# EasyEDA Pro project 3轴6.0__esp32.eprj, board ESP32-AXIS3-6.0
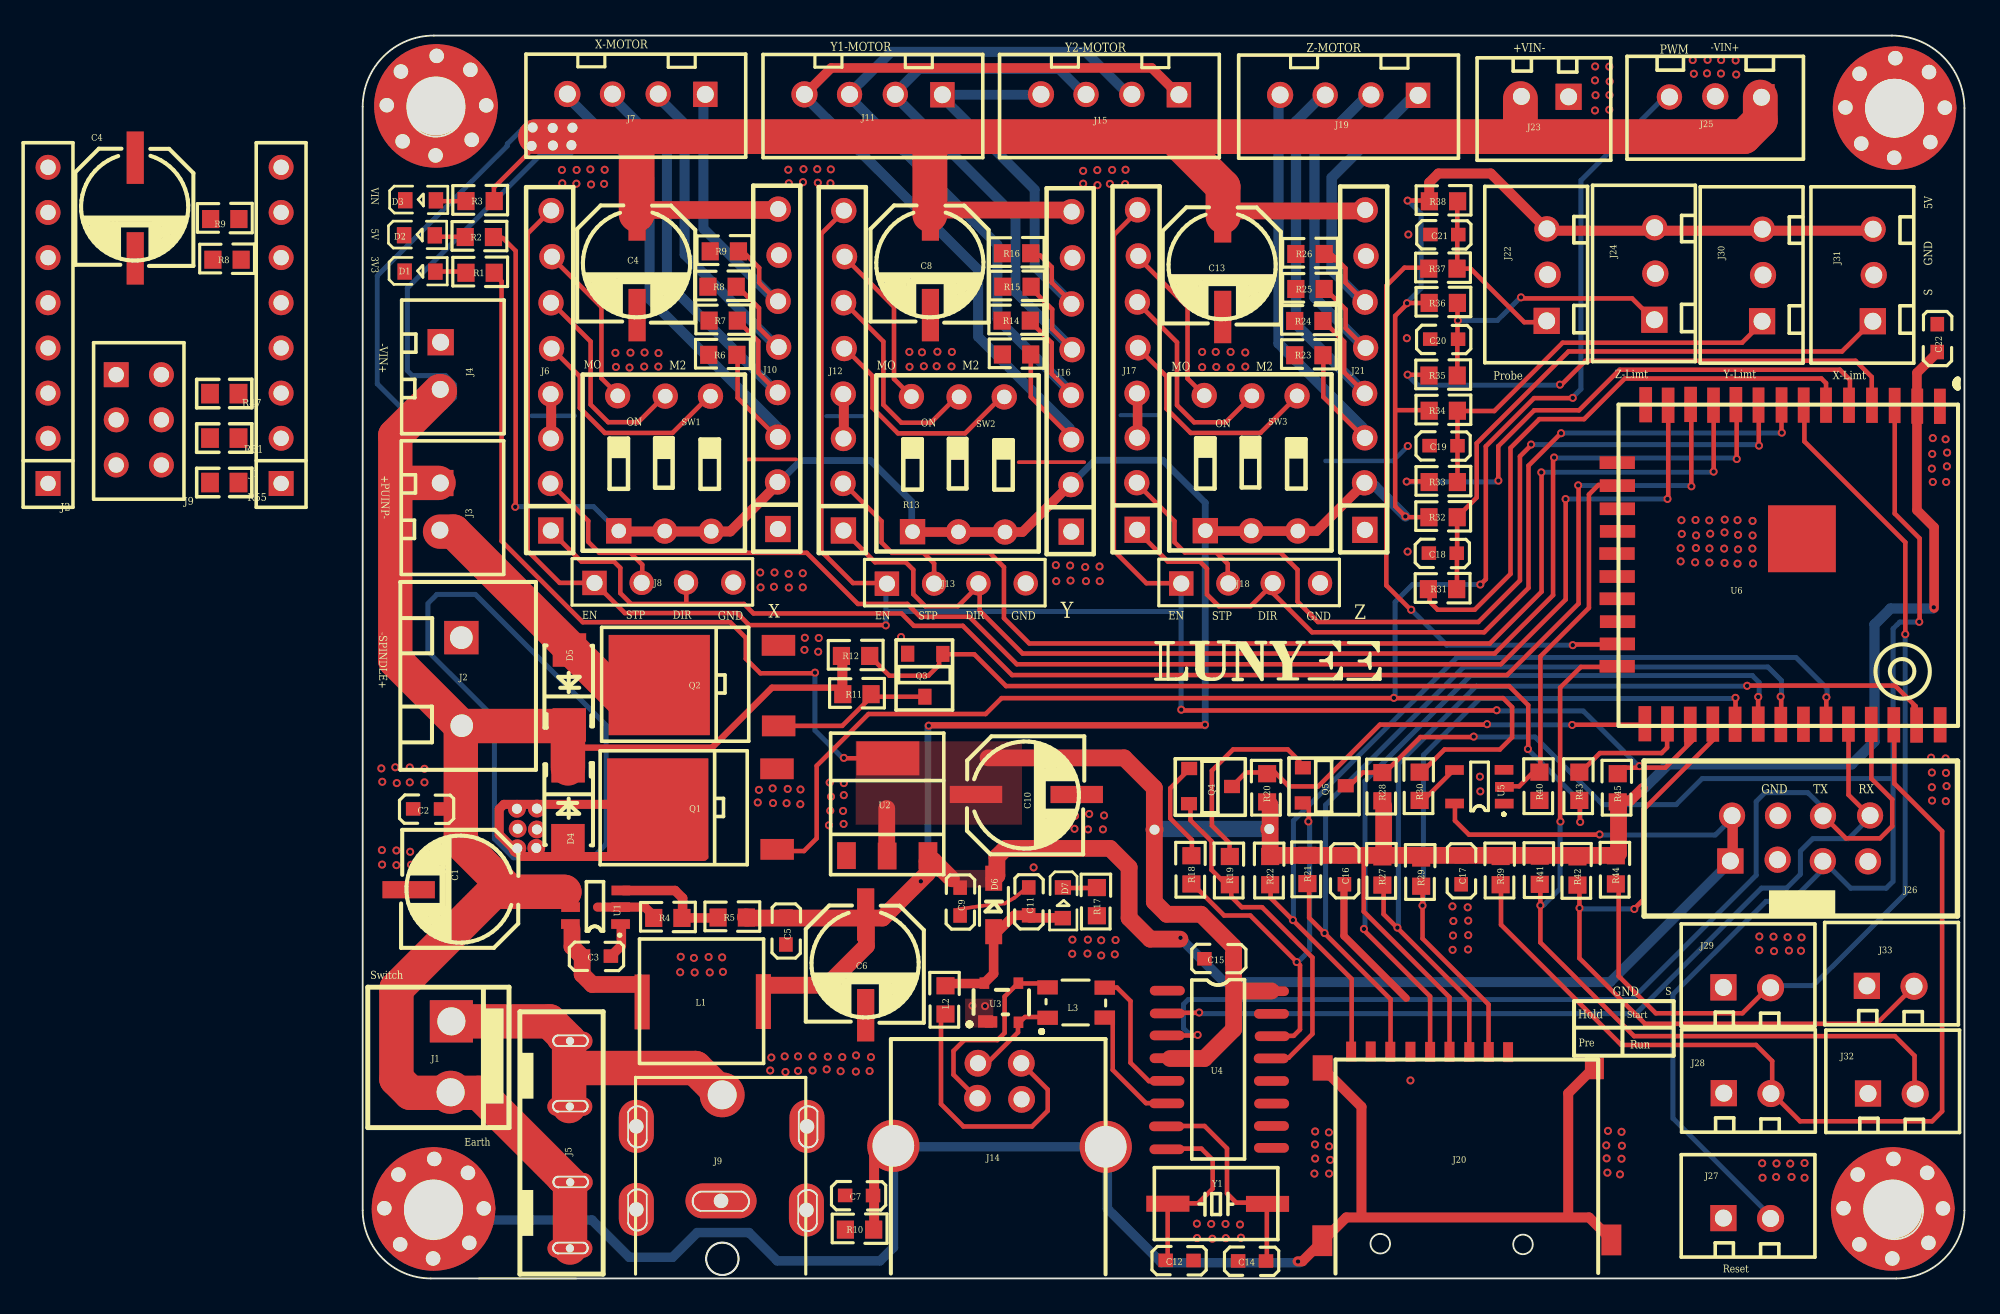
[diagram p1: board, top side]
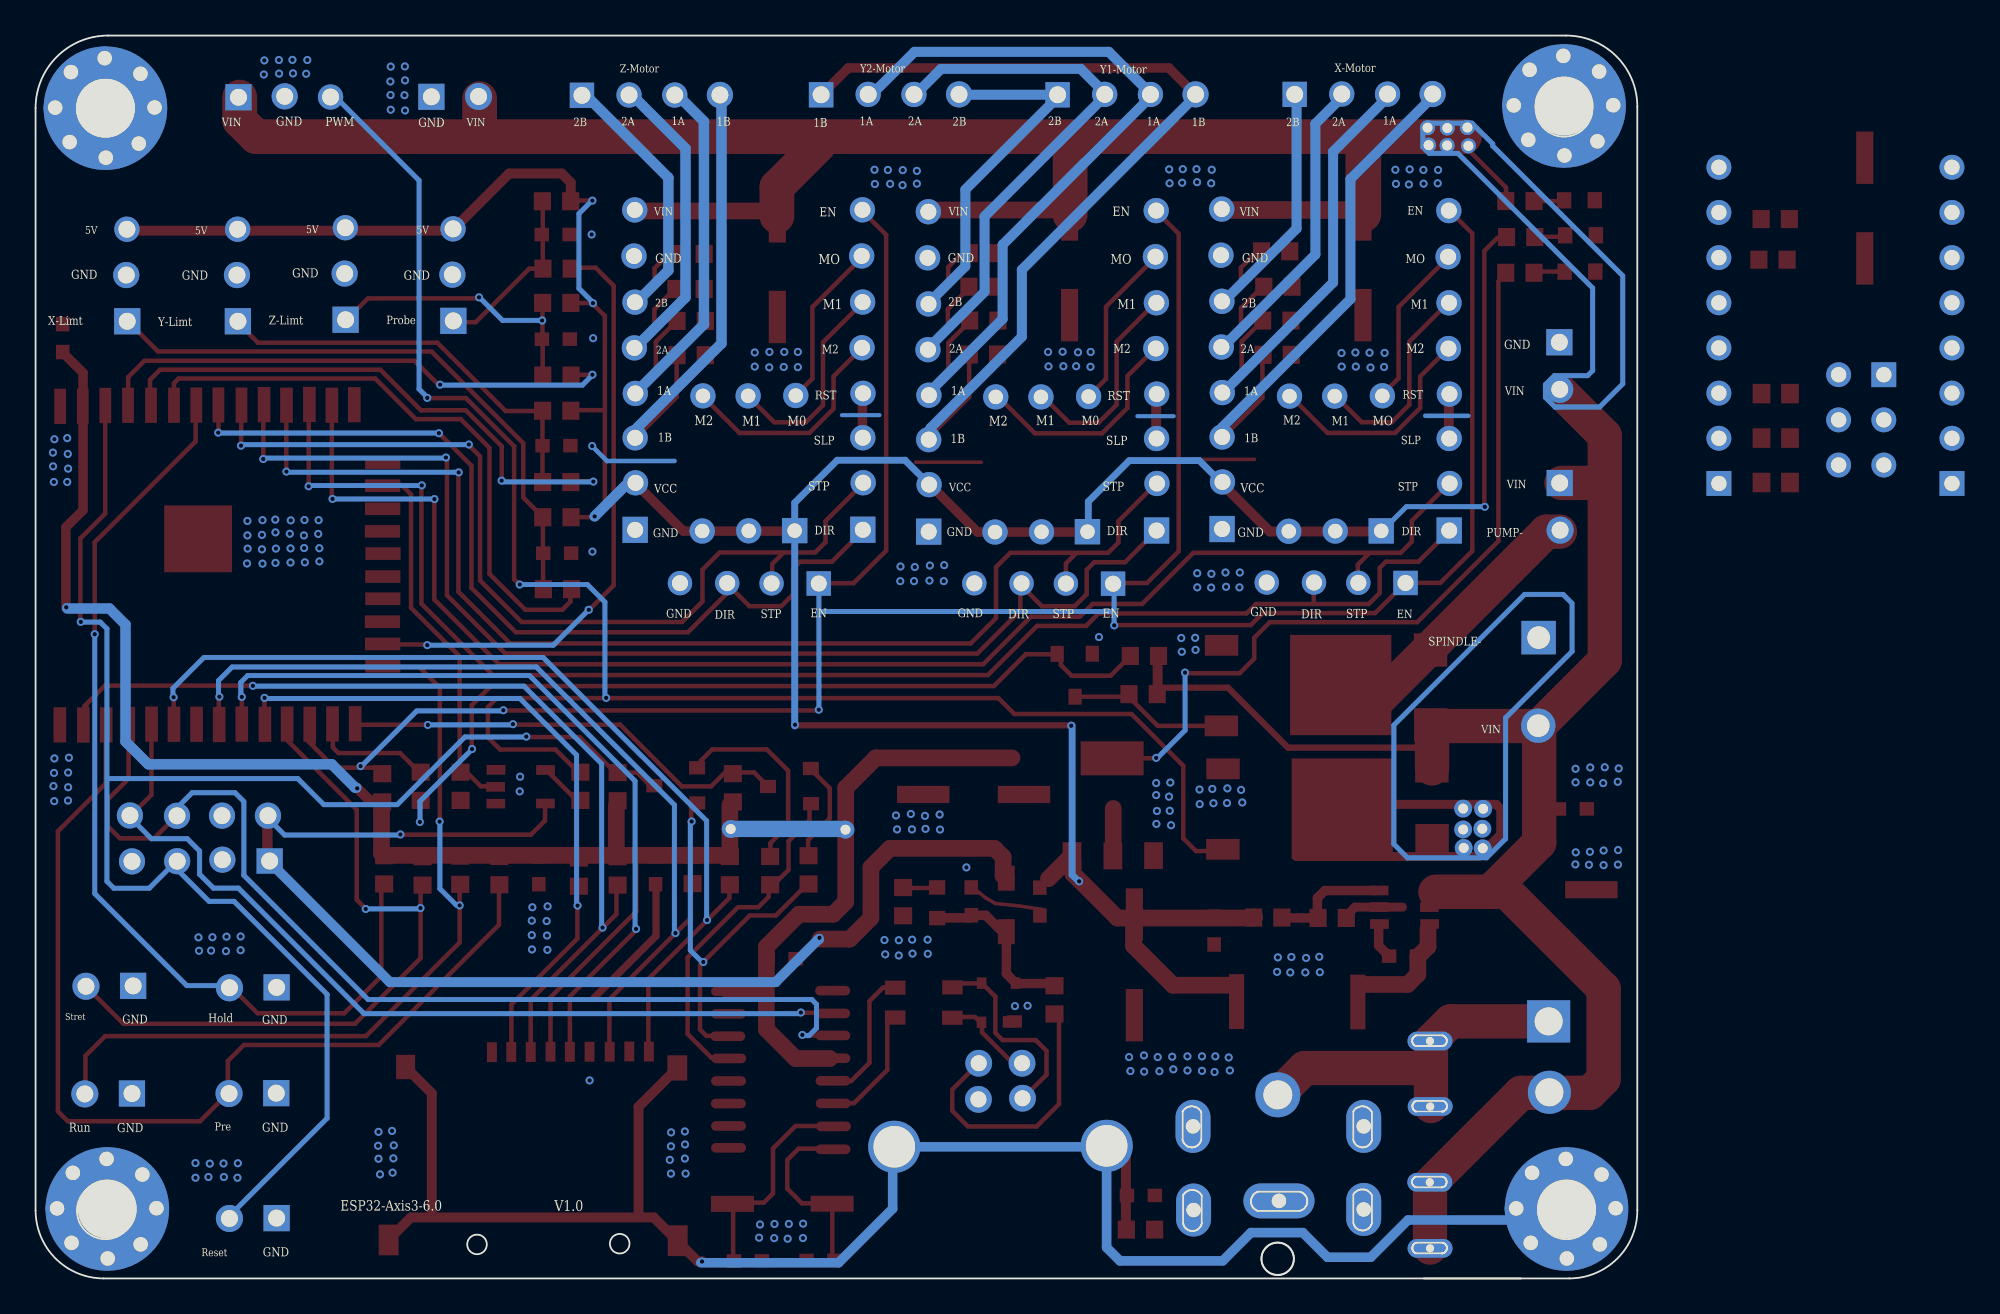
[diagram p2: board, bottom side, seen from below]

Outline 90.02 x 69.89 mm; copper layers: Top Layer, Bottom Layer. Coordinates in mm from the lower left corner of the outline.
Outline path: circle c3.98,3.81 r1.6 ; circle c4.12,65.81 r1.6 ; circle c20.21,1.11 r0.91 ; circle c57.19,1.95 r0.55 ; circle c65.21,1.91 r0.55 ; circle c86.1,65.81 r1.6 ; circle c86.1,3.81 r1.6 ; 11.99,0 3.83,0 arc(1.12,1.12) 0,3.83 0,65.89 arc(1.17,68.72) 4,69.89 85.95,69.89 arc(88.83,68.7) 90.02,65.82 90.02,3.83 arc(88.9,1.12) 86.19,0 6.54,0
Stack: Top Layer 0.0356mm / Dielectric1 0.32mm FR-4 er 4.8 / Bottom Layer 0.0356mm

## Design rules (mm)
net J7: Inside Board Components
net J11: Inside Board Components
net J15: Inside Board Components
net J19: Inside Board Components
net J23: Inside Board Components
net J25: Inside Board Components
net J31: Inside Board Components
net J30: Inside Board Components
net J24: Inside Board Components
net J22: Inside Board Components
net U6: Inside Board Components
net J26: Inside Board Components
net J33: Inside Board Components
net J32: Inside Board Components
net J29: Inside Board Components
net J28: Inside Board Components
net J27: Inside Board Components
net J20: Inside Board Components
net J21: Inside Board Components
net SW3: Inside Board Components
net SW2: Inside Board Components
net C13: Inside Board Components
net C8: Inside Board Components
net C4: Inside Board Components
net J17: Inside Board Components
net J16: Inside Board Components
net J12: Inside Board Components
net J10: Inside Board Components
net J6: Inside Board Components
net SW1: Inside Board Components
net J3: Inside Board Components
net J4: Inside Board Components
net D3: Inside Board Components
net D2: Inside Board Components
net D1: Inside Board Components
net R3: Inside Board Components
net R2: Inside Board Components
net R1: Inside Board Components
net R9: Inside Board Components
net R8: Inside Board Components
net R7: Inside Board Components
net R6: Inside Board Components
net R16: Inside Board Components
net R15: Inside Board Components
net R14: Inside Board Components
net R13: Inside Board Components
net R26: Inside Board Components
net R25: Inside Board Components
net R24: Inside Board Components
net R23: Inside Board Components
net R38: Inside Board Components
net C21: Inside Board Components
net C20: Inside Board Components
net C19: Inside Board Components
net C18: Inside Board Components
net R31: Inside Board Components
net R32: Inside Board Components
net R33: Inside Board Components
net R34: Inside Board Components
net R35: Inside Board Components
net R37: Inside Board Components
net R36: Inside Board Components
net C22: Inside Board Components
net J8: Inside Board Components
net J13: Inside Board Components
net J18: Inside Board Components
net J2: Inside Board Components
net Q2: Inside Board Components
net Q1: Inside Board Components
net D5: Inside Board Components
net D4: Inside Board Components
net R12: Inside Board Components
net R11: Inside Board Components
net Q3: Inside Board Components
net U2: Inside Board Components
net C10: Inside Board Components
net C1: Inside Board Components
net C6: Inside Board Components
net C2: Inside Board Components
net U1: Inside Board Components
net C3: Inside Board Components
net C5: Inside Board Components
net R4: Inside Board Components
net R5: Inside Board Components
net J1: Inside Board Components
net J5: Inside Board Components
net L1: Inside Board Components
net J9: Inside Board Components
net J14: Inside Board Components
net C7: Inside Board Components
net R10: Inside Board Components
net L2: Inside Board Components
net R17: Inside Board Components
net C9: Inside Board Components
net C11: Inside Board Components
net D6: Inside Board Components
net D7: Inside Board Components
net U3: Inside Board Components
net L3: Inside Board Components
net Q4: Inside Board Components
net Q5: Inside Board Components
net U5: Inside Board Components
net R18: Inside Board Components
net R19: Inside Board Components
net R22: Inside Board Components
net R20: Inside Board Components
net R28: Inside Board Components
net R30: Inside Board Components
net R40: Inside Board Components
net R43: Inside Board Components
net R45: Inside Board Components
net R44: Inside Board Components
net R42: Inside Board Components
net R41: Inside Board Components
net R39: Inside Board Components
net R29: Inside Board Components
net R27: Inside Board Components
net R21: Inside Board Components
net C17: Inside Board Components
net C16: Inside Board Components
net C15: Inside Board Components
net U4: Inside Board Components
net Y1: Inside Board Components
net C12: Inside Board Components
net C14: Inside Board Components
spacing Clearance (default): track to track 0.2, other pairs 0.2 to 0.2
track width Width (default): min 0.254, default 0.254, max 0.254
differential pair DiffPairsRouting (default): width min 0.381, default 0.381, max 0.381; gap min 0.254, default 0.254
via RoutingVias (default): diameter min 1.27, default 1.27, max 1.27; hole min 0.711, default 0.711, max 0.711

## Placement (name value [footprint] x y rotation side)
C1  100uF/35V  [9]  6.58 22.42 270 top
C2  104  [11]  4.36 26.1 0 top
C3  104  [11]  13.91 17.83 0 top
C4  104  [9]  14.86 58.17 0 top
C4#2  -  [9]  -13.35 61.36 0 top
C5  100NF  [11]  24.09 20.3 90 top
C6  100uF/35V  [9]  27.71 18.8 0 top
C7  103  [11]  28.64 4.37 0 top
C8  100uF/35V  [9]  31.35 58.17 0 top
C9  104  [11]  33.88 21.93 90 top
C10  104  [9]  36.13 26.65 90 top
C11  100NF  [11]  37.73 21.95 90 top
C12  104  [11]  46.65 0.71 0 top
C13  104  [9]  47.77 58.07 0 top
C14  33PF  [11]  50.73 0.68 0 top
C15  104  [11]  47.35 18.27 180 top
C16  100NF  [11]  55.48 23.69 90 top
C17  105  [11]  62.04 23.69 90 top
C18  103  [11]  61.45 40.49 0 top
C19  100uF/35V  [11]  61.49 46.53 0 top
C20  104  [11]  61.52 52.52 0 top
C21  105  [11]  61.53 58.4 0 top
C22  105  [11]  88.79 53.62 90 top
D1  SS34  [D]  4 56.59 0 top
D2  红光  [D]  3.97 58.64 0 top
D3  红光  [D]  4.03 60.61 0 top
D4  S4  [14]  11.03 24.64 180 top
D5  SS34  [14]  12.13 35.31 0 top
D6  红光  [D1]  35.9 19.38 0 top
D7  红光  [D]  39.33 20.35 270 top
J1  Header 4X2  [18]  4.47 13.7 0 top
J1#2  -  [HDR1X8]  -4.58 54.87 90 top
J2  4P  [HDR1X8]  -17.68 54.87 90 top
J2#2  -  [13]  5.72 34.85 0 top
J3  CON2-2.54MM,黑塑  [2]  4.32 44.52 90 top
J4  CON2-2.54MM,黑塑  [2]  4.34 52.44 90 top
J5  插座,黑塑  [19]  12.12 13.2 0 top
J6  CON8-2.54MM,黄塑  [7]  11.13 43 0 top
J7  CON4-2.54MM,黑塑  [1]  18.71 66.3 0 top
J8  SIP4-2.54MM,黑塑  [12]  13.26 39.09 0 top
J9  -  [21]  24.47 4.2 0 top
J9#2  -  [HDR2X3]  -13.85 50.82 270 top
J10  CON8-2.54MM,黄塑  [7]  23.9 43.08 0 top
J11  CON4-2.54MM,黑塑  [1]  32.04 66.28 0 top
J12  CON8-2.54MM,黄塑  [7]  27.58 43 0 top
J13  SIP4-2.54MM,黑塑  [12]  29.7 39.05 0 top
J14  USB-B，白塑  [22]  34.96 11.6 0 top
J15  CON4-2.54MM,黑塑  [1]  45.33 66.28 0 top
J16  CON8-2.54MM,黄塑  [7]  40.39 42.93 0 top
J17  CON8-2.54MM,黄塑  [7]  44.09 43.04 0 top
J18  SIP4-2.54MM,黑塑  [12]  46.24 39.06 0 top
J19  CON4-2.54MM,黑塑  [1]  58.77 66.25 0 top
J20  TF卡座  [6]  55.69 12.92 0 top
J21  CON8-2.54MM,黄塑  [7]  56.89 43.03 0 top
J22  CON3-2.54MM,黑塑  [3]  66.21 53.9 270 top
J23  CON2-2.54MM,黑塑  [2]  67.56 66.49 0 top
J24  CON3-2.54MM,黑塑  [3]  72.26 53.96 270 top
J25  CON3-2.54MM,黑塑  [3]  78.57 66.09 0 top
J26  CON4X2-2.54MM,黑塑  [5]  77.54 23.47 0 top
J27  CON2-2.54MM,黑塑  [2]  76.69 3.35 180 top
J28  CON2-2.54MM,黑塑  [2]  76.71 10.38 180 top
J29  CON2-2.54MM,黑塑  [2]  76.69 16.33 180 top
J30  CON3-2.54MM,黑塑  [3]  78.32 53.87 270 top
J31  CON3-2.54MM,黑塑  [3]  84.54 53.87 270 top
J32  CON2-2.54MM,黑塑  [2]  84.81 10.36 180 top
J33  CON2-2.54MM,黑塑  [2]  84.75 16.41 180 top
L1  4.7uH  [20]  15.46 15.88 0 top
L2  1UH  [10]  32.87 14.77 90 top
L3  0.22UHX2共模  [24]  39.22 14.58 0 top
NOREF  -  [Pad_ie44]  83.23 3.95 0 top
NOREF#2  -  [Pad_ie27]  2.24 63.94 0 top
NOREF#3  -  [Pad_ie35]  83.33 65.85 0 top
NOREF#4  -  [Pad_ie37]  86.07 63.02 0 top
NOREF#5  -  [Pad_ie53]  1.22 3.95 0 top
NOREF#6  -  [Pad_ie48]  85.99 3.91 0 top
NOREF#7  -  [Pad_ie55]  3.96 1.12 0 top
NOREF#8  -  [Pad_ie59]  9.49 63.69 0 top
NOREF#9  -  [Pad_ie34]  84.13 67.74 0 top
NOREF#10  -  [Pad_ie68]  8.69 24.19 0 top
NOREF#11  -  [Pad_ie54]  2.11 1.92 0 top
NOREF#12  -  [Pad_ie39]  86.1 65.81 0 top
NOREF#13  -  [Pad_ie45]  84.12 1.92 0 top
NOREF#14  -  [Pad_ie61]  10.69 63.71 0 top
NOREF#15  -  [Pad_ie25]  2.15 67.87 0 top
NOREF#16  -  [Pad_ie50]  5.92 5.94 0 top
NOREF#17  -  [Pad_ie21]  35.32 14.43 0 top
NOREF#18  -  [Pad_ie66]  8.71 25.29 0 top
NOREF#19  -  [Pad_ie31]  88.92 65.84 0 top
NOREF#20  -  [Pad_ie49]  6.81 3.94 0 top
NOREF#21  -  [Pad_ie26]  1.35 65.98 0 top
NOREF#22  -  [Pad_ie23]  6.05 67.97 0 top
NOREF#23  -  [Pad_ie47]  88 2 0 top
NOREF#24  -  [Pad_ie40]  88.82 3.94 0 top
NOREF#25  -  [Pad_ie58]  9.55 64.72 0 top
NOREF#26  -  [Pad_ie29]  6.13 64.03 0 top
NOREF#27  -  [Pad_ie46]  85.97 1.12 0 top
NOREF#28  -  [Pad_ie36]  84.22 63.82 0 top
NOREF#29  -  [Pad_ie41]  87.93 5.94 0 top
NOREF#30  -  [Pad_ie28]  4.1 63.15 0 top
NOREF#31  -  [Pad_ie51]  4.02 6.72 0 top
NOREF#32  -  [Pad_ie24]  4.16 68.75 0 top
NOREF#33  -  [Pad_ie70]  50.95 25.27 0 top
NOREF#34  -  [Pad_ie22]  6.94 65.97 0 top
NOREF#35  -  [Pad_ie30]  4.12 65.93 0 top
NOREF#36  -  [Pad_ie38]  88.11 63.9 0 top
NOREF#37  -  [Pad_ie64]  8.67 26.41 0 top
NOREF#38  -  [Pad_ie33]  86.14 68.62 0 top
NOREF#39  -  [Pad_ie42]  86.03 6.72 0 top
NOREF#40  -  [Pad_ie52]  2.01 5.84 0 top
NOREF#41  -  [Pad_ie32]  88.03 67.84 0 top
NOREF#42  -  [Pad_ie67]  9.79 25.25 0 top
NOREF#43  -  [Pad_ie43]  84.02 5.84 0 top
NOREF#44  -  [Pad_ie69]  9.76 24.21 0 top
NOREF#45  -  [Pad_ie71]  44.5 25.24 0 top
NOREF#46  -  [Pad_ie63]  11.73 63.73 0 top
NOREF#47  -  [Pad_ie65]  9.79 26.42 0 top
NOREF#48  -  [Pad_ie57]  3.98 3.91 0 top
NOREF#49  -  [Pad_ie60]  10.68 64.7 0 top
NOREF#50  -  [Pad_ie56]  5.99 2 0 top
NOREF#51  -  [Pad_ie62]  11.79 64.71 0 top
Q1  UTT30N06  [15]  22.39 24.47 0 top
Q2  SS8050  [15]  22.48 31.42 0 top
Q3  SS8050  [16]  32.62 35.07 0 top
Q4  SS8050  [16]  46.5 28.69 90 top
Q5  Y1  [16]  52.9 28.73 90 top
R1  9.1K  [10]  5.7 56.44 0 top
R2  1.69K  [10]  5.66 58.45 0 top
R3  10K  [10]  5.7 60.47 0 top
R4  10K  [10]  16.26 20.16 0 top
R5  10K  [10]  19.88 20.18 0 top
R6  10K  [10]  19.35 51.82 0 top
R7  1.69K  [10]  19.37 53.75 0 top
R8  10K  [10]  19.3 55.65 0 top
R8#2  -  [10]  -8.52 57.17 0 top
R9  100  [10]  19.43 57.64 0 top
R9#2  -  [10]  -8.65 59.46 0 top
R10  100  [10]  27.03 2.63 0 top
R11  100  [10]  26.88 32.74 0 top
R12  10K  [10]  26.81 34.89 0 top
R13  10K  [10]  35.86 51.84 0 top
R14  10K  [10]  35.84 53.75 0 top
R15  1.69K  [10]  35.88 55.65 0 top
R16  10K  [10]  35.86 57.54 0 top
R17  100  [10]  41.38 20.29 90 top
R18  10K 5%  [10]  46.69 22.08 90 top
R19  10K 5%  [10]  48.85 22.04 90 top
R20  0.1  [10]  50.95 26.7 90 top
R21  0.1  [10]  53.21 22.1 90 top
R22  0.1  [10]  51.12 22.04 90 top
R23  0.1  [10]  52.28 51.8 0 top
R24  1.69K 1%  [10]  52.28 53.73 0 top
R25  1.69K 1%  [10]  52.35 55.53 0 top
R26  20K  [10]  52.35 57.49 0 top
R27  20K  [10]  57.43 22.02 90 top
R28  10K 5%  [10]  57.43 26.76 90 top
R29  10K  [10]  59.61 21.96 90 top
R30  10K  [10]  59.52 26.78 90 top
R31  47R 5%  [10]  59.8 38.65 0 top
R32  10K  [10]  59.83 42.69 0 top
R33  10K  [10]  59.84 44.67 0 top
R34  10K 5%  [10]  59.84 48.68 0 top
R35  100  [10]  59.83 50.66 0 top
R36  100  [10]  59.84 54.74 0 top
R37  0.1  [10]  59.82 56.67 0 top
R38  10K?  [10]  59.85 60.46 0 top
R39  10K?  [10]  64.07 22.04 90 top
R40  0.1  [10]  66.25 26.78 90 top
R41  20K  [10]  66.27 22.06 90 top
R42  10K  [10]  68.39 22.02 90 top
R43  10K  [10]  68.5 26.78 90 top
R44  100  [10]  70.55 22.08 90 top
R45  10K?  [10]  70.65 26.7 90 top
R47  10K  [0603R]  -7.78 49.76 0 top
R51  10K  [0603R]  -7.78 47.26 0 top
R55  10K  [0603R]  -7.78 44.76 0 top
SW1  3位拨码开关  [8]  15.07 41.58 0 top
SW2  3位拨码开关  [8]  31.58 41.53 0 top
SW3  3位拨码开关  [8]  48.04 41.59 0 top
U1  RY8310  [U]  14.3 19.82 0 top
U2  1117-3.3  [17]  27.24 23.8 0 top
U3  ESP32-WROOM-32  [23]  34.96 14.66 0 top
U4  CH340G  [25]  45.59 15.99 0 top
U5  HR4988SQ  [U1]  64.04 26.65 0 top
U6  HR4988SQ  [4]  88.87 49.22 0 top
Y1  12M  [26]  46.06 4.49 0 top

## Footprints (pads in the part's own frame, mm; a bottom-side part is the same pattern mirrored in y, then rotated)
1
  rect 1.371x1.423 hole 0.95: 1(0.545,0.286)
  round 1.423 hole 0.95: 2(-2.101,0.307) 3(-4.673,0.301)
  round 1.473 hole 0.95: 4(-7.207,0.307)
2
  rect 1.473x1.473 hole 0.95: 1(0.211,-0.043)
  round 1.524 hole 0.95: 2(-2.439,-0.021)
3
  rect 1.473x1.473 hole 0.95: 1(0.048,0.334)
  round 1.473 hole 0.95: 2(-2.55,0.387)
  round 1.423 hole 0.95: 3(-5.128,0.349)
4
  rect 0.66x1.981 smd: 1(-0.228,-0.18) 2(-1.498,-0.174) 3(-2.768,-0.133) 4(-4.043,-0.121) 5(-5.334,-0.121) 6(-6.625,-0.117) 7(-7.88,-0.111) 8(-9.123,-0.106) 9(-10.419,-0.111)
  rect 0.711x1.981 smd: 10(-11.69,-0.085) 11(-12.948,-0.117) 12(-14.235,-0.074) 13(-15.499,-0.121) 14(-16.759,-0.09) 25(-16.806,-18.029) 26(-15.537,-18.04) 27(-14.256,-18.061) 28(-12.986,-18.05) 29(-11.737,-18.061) 30(-10.435,-18.05) 31(-9.165,-18.071) 32(-7.895,-18.061) 33(-6.625,-18.061) 34(-5.366,-18.05) 35(-4.085,-18.071) 36(-2.815,-18.092) 37(-1.534,-18.103) 38(-0.211,-18.092)
  rect 1.981x0.711 smd: 15(-18.357,-3.349) 16(-18.352,-4.641) 17(-18.352,-5.942) 18(-18.341,-7.213) 19(-18.372,-8.461) 20(-18.362,-9.752) 21(-18.362,-11.002) 22(-18.341,-12.293) 23(-18.352,-13.541) 24(-18.362,-14.801)
  rect 3.81x3.759 smd: 39(-7.98,-7.63)
5
  rect 1.473x1.423 hole 0.95: 1(-0.677,0.005)
  round 1.473 hole 0.95: 2(-0.582,2.556) 3(1.979,0.08) 4(2.001,2.556) 5(4.519,-0.005) 6(4.529,2.546) 7(7.059,-0.016) 8(7.176,2.567)
6
  rect 0.559x1.117 smd: 1(-0.138,-0.164) 2(0.963,-0.159) 3(2.064,-0.174) 4(3.196,-0.174) 5(4.302,-0.18) 6(5.392,-0.174) 7(6.503,-0.191) 8(7.599,-0.185) 9(8.684,-0.196)
  rect 1.117x1.423 smd: 10(-1.736,-1.085)
  rect 1.067x1.371 smd: 11(13.536,-1.032)
  rect 1.117x1.727 smd: 12(-1.757,-10.8) 13(14.489,-10.758)
7
  rect 1.423x1.473 hole 0.9: 1(-0.561,-0.936)
  round 1.423 hole 0.9: 2(-0.582,1.709) 3(-0.561,4.239) 4(-0.572,6.737) 5(-0.518,9.297) 6(-0.55,11.869) 7(-0.497,14.462) 8(-0.54,17.055)
8
  rect 1.423x1.423 hole 0.813: 1(-0.677,0.461)
  round 1.423 hole 0.813: 2(1.905,0.45) 3(4.519,0.439) 4(4.477,8.038) 5(1.937,8.038) 6(-0.741,8.059)
9
  rect 0.965x2.946 smd: 1(0.561,1.661) 2(0.561,-4)
10
  rect 0.965x1.016 smd: 1(0.101,0.117) 2(1.688,0.117)
11
  rect 0.813x0.762 smd: 1(0.043,0.296) 2(-1.524,0.301)
12
  rect 1.371x1.371 hole 0.9: 1(-0.233,0.021)
  round 1.371 hole 0.9: 2(2.418,0.026) 3(4.91,0.043) 4(7.567,0.043)
13
  rect 1.931x1.879 hole 1.27: 1(-0.17,1.19)
  round 1.931 hole 1.27: 2(-0.148,-3.763)
14
  rect 1.879x1.879 smd: 1(-0.508,0.026) 2(-0.518,-4.186)
15
  rect 1.879x1.169 smd: 1(0.899,-0.344) 3(0.889,4.186)
  rect 5.689x5.639 smd: 2(-5.811,1.952)
16
  rect 0.746x0.898 smd: 1(-0.011,0.053) 2(-1.99,0.064) 3(-1.022,-2.355)
17
  rect 1.051x1.508 smd: 1(-0.053,-0.021) 2(2.233,-0.043) 3(4.529,-0.021)
  rect 3.54x1.915 smd: 4(2.276,5.45)
18
  rect 2.422x2.372 hole 1.575: 1(0.518,0.756)
  round 2.422 hole 1.575: 2(0.476,-3.233)
19
  oval 2.524x1.051 hole 0.457: 1(-0.466,0.153) 2(-0.476,-3.53) 3(-0.455,-7.79) 4(-0.471,-11.504)
20
  rect 0.85x3.083 smd: 1(0.243,-0.334) 2(7.059,-0.312)
21
  round 2.524 hole 1.625: 1(-4.265,6.122)
  oval 1.965x2.981 hole 0.813: 2(-9.091,4.35) 3(0.502,4.35) 4(-9.091,-0.323) 5(0.471,-0.354)
  oval 3.997x1.965 hole 0.813: 6(-4.329,0.159)
22
  round 1.508 hole 0.9: 1(-0.376,0.502) 2(2.058,0.502) 3(-0.402,-1.466) 4(2.075,-1.53)
  round 2.93 hole 2.337: 5(-5.133,-4.144) 6(6.805,-4.197)
23
  rect 0.848x0.695 smd: 1(0.048,-0.211)
  rect 0.543x0.644 smd: 2(1.895,-0.26) 3(1.889,1.942) 4(-0.021,1.942)
24
  rect 1.153x0.797 smd: 1(-0.725,0.08) 2(2.487,0.09) 3(2.487,1.772) 4(-0.731,1.788)
25
  oval 1.965x0.543 smd: 1(-0.37,0.196) 2(-0.37,-1.085) 3(-0.381,-2.323) 4(-0.381,-3.603) 5(-0.392,-4.873) 6(-0.402,-6.144) 7(-0.413,-7.435) 8(-0.392,-8.726) 9(5.482,-8.642) 10(5.482,-7.413) 11(5.493,-6.154) 12(5.482,-4.884) 13(5.471,-3.614) 14(5.524,-2.365) 15(5.482,-1.106) 16(5.482,0.164)
26
  rect 2.422x0.898 smd: 1(-0.804,-0.291) 2(4.795,-0.301)
0603R
  rect 1x1.1 smd: 1(-0.8,0) 2(0.8,0)
D
  rect 0.813x0.914 smd: 1(0.085,0.021) 2(-1.641,0.026)
D1
  rect 0.949x1.407 smd: 1(-0.434,0.117) 2(-0.434,3.122)
HDR1X8
  rect 1.4x1.4 hole 0.86: 1(-10.16,0)
  round 1.4 hole 0.86: 2(-7.62,0) 3(-5.08,0) 4(-2.54,0) 5(0,0) 6(2.54,0) 7(5.08,0) 8(7.62,0)
HDR2X3
  rect 1.4x1.4 hole 0.86: 1(0,0)
  round 1.4 hole 0.86: 2(2.54,0) 3(5.08,0) 4(5.08,2.54) 5(2.54,2.54) 6(0,2.54)
Pad_ie21
  rect 0.695x0.644 smd: 5(0,0)
Pad_ie22
  round 1.305 hole 0.813: 4(0,0)
Pad_ie23
  round 1.305 hole 0.813: 5(0,0)
Pad_ie24
  round 1.305 hole 0.813: 6(0,0)
Pad_ie25
  round 1.305 hole 0.813: 7(0,0)
Pad_ie26
  round 1.305 hole 0.813: 8(0,0)
Pad_ie27
  round 1.305 hole 0.813: 9(0,0)
Pad_ie28
  round 1.305 hole 0.813: 10(0,0)
Pad_ie29
  round 1.305 hole 0.813: 11(0,0)
Pad_ie30
  round 6.944 hole 3.302: 12(0,0)
Pad_ie31
  round 1.305 hole 0.813: 13(0,0)
Pad_ie32
  round 1.305 hole 0.813: 14(0,0)
Pad_ie33
  round 1.305 hole 0.813: 15(0,0)
Pad_ie34
  round 1.305 hole 0.813: 16(0,0)
Pad_ie35
  round 1.305 hole 0.813: 17(0,0)
Pad_ie36
  round 1.305 hole 0.813: 18(0,0)
Pad_ie37
  round 1.305 hole 0.813: 19(0,0)
Pad_ie38
  round 1.305 hole 0.813: 20(0,0)
Pad_ie39
  round 6.944 hole 3.302: 21(0,0)
Pad_ie40
  round 1.305 hole 0.813: 22(0,0)
Pad_ie41
  round 1.305 hole 0.813: 23(0,0)
Pad_ie42
  round 1.305 hole 0.813: 24(0,0)
Pad_ie43
  round 1.305 hole 0.813: 25(0,0)
Pad_ie44
  round 1.305 hole 0.813: 26(0,0)
Pad_ie45
  round 1.305 hole 0.813: 27(0,0)
Pad_ie46
  round 1.305 hole 0.813: 28(0,0)
Pad_ie47
  round 1.305 hole 0.813: 29(0,0)
Pad_ie48
  round 6.944 hole 3.302: 30(0,0)
Pad_ie49
  round 1.305 hole 0.813: 31(0,0)
Pad_ie50
  round 1.305 hole 0.813: 32(0,0)
Pad_ie51
  round 1.305 hole 0.813: 33(0,0)
Pad_ie52
  round 1.305 hole 0.813: 34(0,0)
Pad_ie53
  round 1.305 hole 0.813: 35(0,0)
Pad_ie54
  round 1.305 hole 0.813: 36(0,0)
Pad_ie55
  round 1.305 hole 0.813: 37(0,0)
Pad_ie56
  round 1.305 hole 0.813: 38(0,0)
Pad_ie57
  round 6.944 hole 3.302: 39(0,0)
Pad_ie58
  round 0.848 hole 0.559: 40(0,0)
Pad_ie59
  round 0.848 hole 0.559: 41(0,0)
Pad_ie60
  round 0.848 hole 0.559: 42(0,0)
Pad_ie61
  round 0.848 hole 0.559: 43(0,0)
Pad_ie62
  round 0.848 hole 0.559: 44(0,0)
Pad_ie63
  round 0.848 hole 0.559: 45(0,0)
Pad_ie64
  round 1 hole 0.559: 46(0,0)
Pad_ie65
  round 1 hole 0.559: 47(0,0)
Pad_ie66
  round 1 hole 0.559: 48(0,0)
Pad_ie67
  round 1 hole 0.559: 49(0,0)
Pad_ie68
  round 1 hole 0.559: 50(0,0)
Pad_ie69
  round 1 hole 0.559: 51(0,0)
Pad_ie70
  round 1 hole 0.559: 52(0,0)
Pad_ie71
  round 1 hole 0.559: 53(0,0)
U
  rect 1.051x0.543 smd: 1(0.196,0.111) 2(0.201,1.063) 3(0.211,2.001) 4(-2.609,2.006) 5(-2.614,1.063) 6(-2.624,0.111)
U1
  rect 1.051x0.543 smd: 1(0.117,0.048) 2(0.127,0.99) 3(0.106,1.948) 4(-2.678,1.937) 5(-2.672,0.053)

## Nets
24V: J1#2.8
GND: J1#2.1 J1#2.7 R47.2 R51.2 R55.2
VCC: J1#2.2 J9#2.4 J9#2.5 J9#2.6
MOTOR_EN: J2.8
MX_1A: J1#2.4
MX_1B: J1#2.3
MX_2A: J1#2.5
MX_2B: J1#2.6
MX_DIR: J2.1
MX_DIV1: J2.5 J9#2.3 R55.1
MX_DIV2: J2.6 J9#2.2 R51.1
MX_DIV3: J2.7 J9#2.1 R47.1
MX_STEP: J2.2
NETJ2_3: J2.3 J2.4
UNNAMEDNET1: J7.1 J10.6 R9.2 R9#2.2
UNNAMEDNET2: J7.2 J10.5 R8.2 R8#2.2
UNNAMEDNET3: J7.3 J10.4 R7.2
UNNAMEDNET4: J7.4 J10.3 R6.2
UNNAMEDNET5: J11.1 J15.4 J16.6 R16.2
UNNAMEDNET6: J11.2 J15.3 J16.5 R15.2
UNNAMEDNET7: J11.3 J15.2 J16.4 R14.2
UNNAMEDNET8: J11.4 J15.1 J16.3 R13.2
UNNAMEDNET9: J19.1 J21.6 R26.2
UNNAMEDNET10: J19.2 J21.5 R25.2
UNNAMEDNET11: J19.3 J21.4 R24.2
UNNAMEDNET12: J19.4 J21.3 R23.2
UNNAMEDNET13: C1.2 C2.2 C4.2 C4#2.2 C5.2 C6.2 C7.2 C8.2 C9.2 C10.2 C11.1 C12.1 C13.2 C14.2 C15.1 C16.2 C17.2 C18.2 C19.2 C20.2 C21.2 C22.1 D1.2 D2.2 D3.2 J4.1 J8.4 J9.2 J9.3 J9.4 J9.5 J9.6 J10.1 J10.7 J13.4 J14.4 J16.1 J16.7 J18.4 J20.4 J21.1 J21.7 J22.2 J23.1 J24.2 J25.2 J26.3 J26.4 J27.1 J28.1 J29.1 J30.2 J31.2 J32.1 J33.1 NOREF#17.5 Q1.3 Q2.3 Q3.2 R4.1 R6.1 R7.1 R8.1 R8#2.1 R9.1 R9#2.1 R10.1 R13.1 R14.1 R15.1 R16.1 R17.1 R23.1 R24.1 R25.1 R26.1 R40.1 U1.2 U2.1 U3.1 U4.1 U5.3 U6.1 U6.15 U6.38 U6.39
UNNAMEDNET14: C1.1 C2.1 C4.1 C4#2.1 C8.1 C13.1 D4.2 D5.2 J1.2 J2#2.2 J3.1 J4.2 J5.3 J5.4 J10.8 J16.8 J21.8 J23.2 J25.1 NOREF#8.41 NOREF#14.43 NOREF#25.40 NOREF#46.45 NOREF#49.42 NOREF#51.44 R3.2 R11.1 R12.1 U1.4 U1.5
UNNAMEDNET15: J25.3 Q1.1 R30.2
UNNAMEDNET16: C18.1 J31.1 R31.2 R32.2
UNNAMEDNET17: C5.1 C6.1 C9.1 D6.2 J10.2 J16.2 J21.2 J22.3 J24.3 J26.1 J26.2 J30.3 J31.3 L1.2 R2.2 R5.2 R32.1 R34.1 R36.1 R38.1 SW1.1 SW1.2 SW1.3 SW2.1 SW2.2 SW2.3 SW3.1 SW3.2 SW3.3 U2.3 U5.5
UNNAMEDNET18: C19.1 J30.1 R33.2 R34.2
UNNAMEDNET19: C20.1 J24.1 R35.2 R36.2
UNNAMEDNET20: C21.1 J22.1 R37.2 R38.2
UNNAMEDNET21: C10.1 C15.2 C16.1 C17.1 C22.2 J20.6 NOREF#33.52 NOREF#45.53 R1.2 R20.1 R21.2 R22.2 R27.2 R28.1 R29.2 R39.2 R41.2 R42.2 R44.2 R45.1 U2.2 U2.4 U4.4 U4.16 U6.2
UNNAMEDNET22: J26.5 J27.2 Q5.3 R28.2 U6.3
UNNAMEDNET23: R35.1 U6.4
UNNAMEDNET24: R33.1 U6.5
UNNAMEDNET25: R31.1 U6.6
UNNAMEDNET26: J29.2 R44.1 U6.7
UNNAMEDNET27: J17.1 J18.3 U6.8
UNNAMEDNET28: J17.2 J18.2 U6.9
UNNAMEDNET29: J12.1 J13.3 U6.10
UNNAMEDNET30: J12.2 J13.2 U6.11
UNNAMEDNET31: J6.1 J8.3 U6.12
UNNAMEDNET32: J6.2 J8.2 U6.13
UNNAMEDNET33: U6.14
UNNAMEDNET34: R40.2 U5.2 U6.16
UNNAMEDNET35: U6.17
UNNAMEDNET36: U6.18
UNNAMEDNET37: U6.19
UNNAMEDNET38: U6.20
UNNAMEDNET39: U6.21
UNNAMEDNET40: U6.22
UNNAMEDNET41: R37.1 U6.23
UNNAMEDNET42: J32.2 R41.1 U6.24
UNNAMEDNET43: Q4.3 R20.2 U6.25
UNNAMEDNET44: R43.2 U6.26
UNNAMEDNET45: J6.8 J8.1 J12.8 J13.1 J17.8 J18.1 R45.2 U6.27
UNNAMEDNET46: J33.2 R42.1 U6.28
UNNAMEDNET47: J20.8 R29.1 U6.29
UNNAMEDNET48: J20.5 U6.30
UNNAMEDNET49: J20.3 R21.1 U6.31
UNNAMEDNET50: U6.32
UNNAMEDNET51: J20.1 R22.1 U6.33
UNNAMEDNET52: J26.8 U4.2 U6.34
UNNAMEDNET53: J26.6 U4.3 U6.35
UNNAMEDNET54: J28.2 R39.1 U6.36
UNNAMEDNET55: J20.7 R27.1 U6.37
UNNAMEDNET56: J26.7
UNNAMEDNET57: J20.2
UNNAMEDNET58: J20.9
UNNAMEDNET59: C7.1 J14.5 J14.6 J20.10 J20.11 J20.12 J20.13 NOREF#5.35 NOREF#7.37 NOREF#11.36 NOREF#16.32 NOREF#20.31 NOREF#31.33 NOREF#40.34 NOREF#48.39 NOREF#50.38 R10.2
UNNAMEDNET60: J17.5 SW3.4
UNNAMEDNET61: J17.6 SW3.5
UNNAMEDNET62: J17.7 SW3.6
UNNAMEDNET63: J12.5 SW2.4
UNNAMEDNET64: J12.6 SW2.5
UNNAMEDNET65: J12.7 SW2.6
UNNAMEDNET66: J17.3 J17.4
UNNAMEDNET67: J12.3 J12.4
UNNAMEDNET68: J6.3 J6.4
UNNAMEDNET69: J6.5 SW1.4
UNNAMEDNET70: J6.6 SW1.5
UNNAMEDNET71: J6.7 SW1.6
UNNAMEDNET72: D5.1 J3.2 Q2.2
UNNAMEDNET73: D3.1 R3.1
UNNAMEDNET74: D2.1 R2.1
UNNAMEDNET75: D1.1 R1.1
UNNAMEDNET76: D4.1 J2#2.1 NOREF#10.50 NOREF#18.48 NOREF#37.46 NOREF#42.49 NOREF#44.51 NOREF#47.47 Q1.2
UNNAMEDNET77: Q2.1 Q3.3 R11.2
UNNAMEDNET78: Q3.1 R12.2 R43.1
UNNAMEDNET79: C3.1 U1.1
UNNAMEDNET80: R4.2 R5.1 U1.3
UNNAMEDNET81: C3.2 L1.1 U1.6
UNNAMEDNET82: J1.1 J5.1 J5.2 J9.1
UNNAMEDNET83: J14.1 L3.1 U3.2
UNNAMEDNET84: J14.2 L2.1
UNNAMEDNET85: J14.3 L3.4 U3.3
UNNAMEDNET86: C11.2 D6.1 D7.1 L2.2 U3.4
UNNAMEDNET87: D7.2 R17.2
UNNAMEDNET88: L3.2 U4.6
UNNAMEDNET89: L3.3 U4.5
UNNAMEDNET90: Q4.1 R18.2
UNNAMEDNET91: Q4.2 R19.1 U4.13
UNNAMEDNET92: Q5.1 R19.2
UNNAMEDNET93: Q5.2 R18.1 U4.14
UNNAMEDNET94: U5.1
UNNAMEDNET95: R30.1 U5.4
UNNAMEDNET96: C14.1 U4.7 Y1.2
UNNAMEDNET97: C12.2 U4.8 Y1.1
UNNAMEDNET98: U4.9
UNNAMEDNET99: U4.10
UNNAMEDNET100: U4.11
UNNAMEDNET101: U4.12
UNNAMEDNET102: U4.15

Pads without a net: NOREF 26; NOREF#2 9; NOREF#3 17; NOREF#4 19; NOREF#6 30; NOREF#9 16; NOREF#12 21; NOREF#13 27; NOREF#15 7; NOREF#19 13; NOREF#21 8; NOREF#22 5; NOREF#23 29; NOREF#24 22; NOREF#26 11; NOREF#27 28; NOREF#28 18; NOREF#29 23; NOREF#30 10; NOREF#32 6; NOREF#34 4; NOREF#35 12; NOREF#36 20; NOREF#38 15; NOREF#39 24; NOREF#41 14; NOREF#43 25

## Via types
v1: diameter 0.45, hole 0.25, Top Layer to Bottom Layer, 321 vias

## Routing (per net, layer and track width the routed paths; a pad name or vN(x,y) marks a point on that pad's centre or on a via; arc(x,y) is an arc through that point)
UNNAMEDNET1: length 16.6
  Top Layer w0.254: 23.21,55.09 23.18,55.09 22.28,55.99 22.28,56.83 21.23,57.89
  Bottom Layer w0.559: 23.24,54.95 19.15,59.04 19.15,66.27
UNNAMEDNET2: length 21.2
  Top Layer w0.254: 21.12,55.72 22.27,54.57 22.27,53.45 23.32,52.41 23.32,52.23
  Bottom Layer w0.559: 16.42,66.43 16.6,66.43 18.09,64.93 18.09,57.58 23.19,52.48
UNNAMEDNET3: length 25.8
  Top Layer w0.254: 23.08,49.81 23.08,50.08 22.24,50.93 22.24,52.69 21.03,53.9
  Bottom Layer w0.559: 23.38,49.54 23.38,49.72 17.1,56 17.1,63.36 13.93,66.52
UNNAMEDNET4: length 29.1
  Top Layer w0.254: 21.07,51.75 21.07,49.52 23.16,47.43
  Bottom Layer w0.559: 23.33,47.3 23.33,47.86 16.12,55.07 16.12,61.82 11.63,66.32 11.63,66.36
UNNAMEDNET5: length 23.6
  Top Layer w0.254: 37.6,57.53 38.07,57.53 38.73,56.87 38.73,56 39.6,55.13
  Bottom Layer w0.559: 37.67,66.61 37.63,66.56 32.63,66.56 32.81,66.38 32.81,66.18 37.77,61.23 37.77,56.91 40.08,54.59
UNNAMEDNET6: length 34.4
  Top Layer w0.254: 37.61,55.63 37.62,55.63 38.75,54.5 38.75,53.39 39.8,52.35
  Bottom Layer w0.559: 40.1,52.32 39.85,52.32 36.69,55.48 36.69,59.72 30.06,66.34 30.06,66.8 31.28,68.02 39.13,68.02 40.44,66.7
UNNAMEDNET7: length 44.2
  Top Layer w0.254: 37.52,53.74 37.59,53.74 38.72,52.61 38.72,50.87 39.67,49.92
  Bottom Layer w0.559: 43.24,66.66 42.94,66.66 40.62,68.98 29.7,68.98 27.48,66.75 27.48,66.32 35.67,58.13 35.67,53.96 39.67,49.96
UNNAMEDNET8: length 52.5
  Top Layer w0.254: 39.64,47.48 37.55,49.57 37.55,51.78
  Top Layer w0.533: 45.79,66.62 44.34,68.07 26.33,68.07 24.92,66.66 24.92,66.65
  Bottom Layer w0.559: 24.93,66.38 34.59,56.72 34.59,52.95 39.72,47.82 39.72,47.24
UNNAMEDNET9: length 18.1
  Top Layer w0.254: 54.31,57.73 55.23,56.81 55.23,56 56.16,55.08 56.16,54.9 ; 54.36,57.25 54.73,57.25
  Bottom Layer w0.584: 59.08,66.56 59.08,66.52 54.46,61.9 54.46,56.69 56.13,55.02
UNNAMEDNET10: length 20.2
  Top Layer w0.254: 56.19,52.5 56.17,52.5 55.25,53.43 55.25,54.49 54.31,55.43
  Bottom Layer w0.584: 56.46,66.51 53.49,63.55 53.49,55.17 56.22,52.44 56.22,52.37
UNNAMEDNET11: length 23.4
  Top Layer w0.254: 54.21,53.63 55.16,52.68 55.16,50.96 56,50.12 56,49.81
  Bottom Layer w0.584: 53.84,66.56 53.84,66.45 52.46,65.06 52.46,53.65 56.25,49.86
UNNAMEDNET12: length 26.4
  Top Layer w0.254: 56.22,47.38 56.18,47.38 53.99,49.57 53.99,51.69
  Bottom Layer w0.584: 56.19,47.2 56.19,47.86 51.47,52.58 51.47,66.42
UNNAMEDNET13: length 32.8
  Top Layer w0.202: 37.22,21.88 36.63,21.41 36.08,21.09 34.77,20.95 33.46,20.75 ; 21.52,46.06 24.36,46.06 ; 36.87,45.9 40.56,45.9
  Top Layer w0.406: 55.15,21.94 55.15,19.26 58.65,15.76
  Top Layer w0.506: 13.2,20.88 15.86,20.88 16.28,20.47
  Bottom Layer w0.226: 26.06,48.49 28.1,48.49 ; 42.59,48.55 44.7,48.55
  Bottom Layer w0.251: 9.5,48.51 11.92,48.51 ; 54.11,45.97 57.91,45.97 58.63,46.69
  vias: v1(1.05,28.68) v1(1.1,27.93) v1(1.08,24.09) v1(1.09,23.27) v1(1.83,28.74) v1(1.92,27.86) v1(1.89,24.07) v1(1.89,23.24) v1(2.65,28.73) v1(2.65,27.9) v1(2.67,23.99) v1(2.72,23.26) v1(3.47,28.66) v1(3.47,27.9) v1(3.46,23.96) v1(3.48,23.28) v1(11.2,62.34) v1(11.22,61.58) v1(12.02,62.34) v1(12.01,61.56) v1(12.8,62.37) v1(12.84,61.52) v1(13.6,62.35) v1(13.57,61.55) v1(14.2,52.05) v1(14.23,51.26) v1(15,51.22) v1(15.05,52.06) v1(15.82,51.28) v1(15.84,52.07) v1(16.63,52.04) v1(16.62,51.28) v1(17.88,18.09) v1(17.84,17.22) v1(18.62,18.02) v1(18.66,17.21) v1(19.44,18.08) v1(19.5,17.21) v1(20.2,18.06) v1(20.25,17.24) v1(22.2,26.77) v1(22.27,27.47) v1(22.34,39.7) v1(22.36,38.86) v1(22.9,11.7) v1(22.97,12.43) v1(23.11,38.89) v1(23.04,27.56) v1(23.06,26.73) v1(23.15,39.7) v1(23.72,12.49) v1(23.82,26.72) v1(23.76,11.61) v1(23.92,62.35) v1(23.89,27.53) v1(23.95,61.58) v1(23.94,39.62) v1(23.95,38.85) v1(24.47,12.49) v1(24.47,11.67) v1(24.61,27.5) v1(24.6,26.67) v1(24.78,62.38) v1(24.74,61.65) v1(24.73,39.66) v1(24.73,38.86) v1(24.85,36.03) v1(24.83,35.35) v1(25.28,12.49) v1(25.28,11.7) v1(25.55,62.38) v1(25.58,61.62) v1(25.6,35.24) v1(25.63,36.02) v1(26.08,11.76) v1(26.2,25.49) v1(26.14,12.47) v1(26.31,62.37) v1(26.29,61.58) v1(26.25,27.89) v1(26.32,27.09) v1(26.28,26.3) v1(26.86,11.65) v1(27,26.29) v1(26.96,12.45) v1(27.04,27.86) v1(27.04,27.18) v1(27.03,25.56) v1(27.72,11.63) v1(27.73,12.54) v1(28.49,11.66) v1(28.56,12.45) v1(30.26,36.07) v1(30.72,52.1) v1(30.73,51.27) v1(31.43,52.08) v1(31.54,51.3) v1(32.3,52.11) v1(32.26,51.3) v1(33.12,52.1) v1(33.09,51.29) v1(34.27,15.34) v1(34.98,15.31) v1(37.71,23.11) v1(38.96,40.11) v1(38.98,39.21) v1(39.21,26.09) v1(39.19,25.24) v1(39.76,40.09) v1(39.78,39.24) v1(39.89,19.05) v1(39.88,18.26) v1(40,25.28) v1(40.04,26.01) v1(40.49,62.28) v1(40.49,61.56) v1(40.61,40) v1(40.65,39.21) v1(40.77,25.25) v1(40.76,19.05) v1(40.74,18.27) v1(40.83,26.12) v1(41.29,62.33) v1(41.3,61.48) v1(41.41,40.04) v1(41.42,39.21) v1(41.51,19.02) v1(41.51,18.16) v1(41.6,25.25) v1(41.67,26.03) v1(41.99,61.55) v1(42.12,62.34) v1(42.31,19.03) v1(42.27,18.22) v1(42.87,62.35) v1(42.85,61.54) v1(46.88,3.08) v1(46.89,2.27) v1(47.18,52.1) v1(47.18,51.24) v1(47.69,3.06) v1(47.75,2.23) v1(47.94,52.1) v1(47.97,51.26) v1(48.49,3.06) v1(48.51,2.27) v1(48.78,52.1) v1(48.79,51.23) v1(49.31,3.03) v1(49.36,2.29) v1(49.6,52.07) v1(49.6,51.28) v1(53.52,7.54) v1(53.49,5.9) v1(53.53,8.27) v1(53.53,6.74) v1(54.3,8.21) v1(54.31,7.43) v1(54.31,5.9) v1(54.38,6.67) v1(58.68,52.87) v1(58.73,40.87) v1(58.77,58.71) v1(58.74,46.81) v1(58.89,11.13) v1(61.25,20.92) v1(61.3,20.1) v1(61.28,19.28) v1(61.26,18.48) v1(62.1,20.87) v1(62.12,18.5) v1(62.13,20.12) v1(62.13,19.3) v1(62.79,28.22) v1(62.81,27.39) v1(69.27,68.16) v1(69.26,67.37) v1(69.29,66.54) v1(69.26,65.68) v1(69.89,7.48) v1(69.91,6.75) v1(69.99,8.3) v1(69.96,5.95) v1(70.06,68.15) v1(70.08,67.31) v1(70.07,66.55) v1(70.06,65.72) v1(70.67,5.85) v1(70.75,8.24) v1(70.77,7.46) v1(70.75,6.73) v1(74.12,42.64) v1(74.07,41.06) v1(74.07,40.32) v1(74.14,41.87) v1(74.75,68.52) v1(74.81,67.74) v1(74.91,42.65) v1(74.89,40.27) v1(74.94,41.78) v1(74.93,41.07) v1(75.59,68.53) v1(75.55,67.77) v1(75.68,42.63) v1(75.69,41.05) v1(75.69,40.26) v1(75.73,41.88) v1(76.35,68.52) v1(76.34,67.75) v1(76.52,41.04) v1(76.55,42.67) v1(76.54,41.95) v1(76.54,40.24) v1(77.16,68.5) v1(77.19,67.7) v1(77.27,42.64) v1(77.3,41.81) v1(77.3,41) v1(77.27,40.2) v1(78.12,42.6) v1(78.12,41.78) v1(78.11,41.04) v1(78.14,40.21) v1(78.5,19.23) v1(78.5,18.46) v1(78.66,6.48) v1(78.68,5.66) v1(79.29,19.22) v1(79.32,18.4) v1(79.46,6.47) v1(79.44,5.7) v1(80.08,19.19) v1(80.16,18.44) v1(80.23,6.46) v1(80.31,5.7) v1(80.87,19.18) v1(80.84,18.43) v1(81.04,6.49) v1(81.04,5.66) v1(88.21,46.37) v1(88.19,45.54) v1(88.15,29.28) v1(88.19,28.45) v1(88.19,27.62) v1(88.2,26.87) v1(88.24,47.25) v1(88.24,44.79) v1(88.96,47.19) v1(89,44.79) v1(88.96,29.24) v1(88.98,28.43) v1(89.02,27.69) v1(88.97,26.84) v1(89.05,46.44) v1(89.04,45.67)
UNNAMEDNET14: length 256.5
  Top Layer w0.251: 9.63,63.6 7.38,61.35 7.38,60.7
  Top Layer w0.355: 11.92,29.85 19.63,29.85 23,33.22 26.96,33.22 ; 26.86,32.84 26.86,34.61 ; 27.06,32.79 27.06,34.6
  Top Layer w0.381: 11.91,29.87 11.92,29.85
  Top Layer w0.94: 48.77,60.03 56.42,60.03 ; 32.57,60.08 39.66,60.08
  Top Layer w0.991: 15.67,60.08 23.01,60.08 23.01,60.06
  Top Layer w1.931: 11.65,1.74 11.65,5.32 6.54,10.44 2.68,10.44 1.89,11.22 1.89,16.29 7.34,21.74 11.33,21.74 8.28,21.74 5.51,24.5 5.51,31.07 1.83,34.76 1.83,47.39 4.34,49.9 ; 5.68,31.06 11.44,31.06 11.54,30.97 11.54,28.68 ; 2.65,44.74 4.26,44.74
  Top Layer w1.956: 9.72,64.21 77.63,64.21 78.55,65.13 78.55,66.43 ; 65.07,64.8 65.07,66.35 ; 48.36,59.73 48.36,61.38 46.01,63.73 ; 31.88,59.81 31.88,63.37
  Top Layer w2.006: 15.4,59.84 15.4,64.04
  Bottom Layer w0.28: 4.38,49 4.62,49 5.16,49.54 5.16,50.27 4.66,50.77 2.79,50.77 2.51,51.05 2.51,55.7 10.08,63.27 11.69,63.27 12.05,63.63 12.05,64.7 11.78,64.97 9.29,64.97 8.13,63.8 8.13,63.69 0.82,56.38 0.82,50.3 2.12,49.01 4.47,49.01
UNNAMEDNET15: length 97.9
  Top Layer w0.254: 67.97,49.5 65.83,49.5 63.12,46.79 63.12,39.32 62.8,38.99 ; 59.57,28.48 59.57,28.52 60.8,29.74 63.91,29.74 64.6,30.43 64.6,32.13 64.09,32.63 35.9,32.63 35.01,31.74 28.43,31.74 25.52,28.83 25.52,24.75 24.8,24.03 23.89,24.03
  Bottom Layer w0.28: 68.02,49.54 68.02,49.57 68.47,50.01 68.47,61.75 73.21,66.49 ; 58.02,32.72 58.02,38.04 59.01,39.02 62.73,39.02
  vias: v1(57.95,32.65) v1(62.81,39.02) v1(68.01,49.52)
UNNAMEDNET16: length 33.2
  Top Layer w0.254: 61.5,38.86 61.5,40.71 61.51,40.72 61.51,42.81 62.61,43.92 62.61,46.97 67.77,52.13 83.14,52.13 84.55,53.54
UNNAMEDNET17: length 252.4
  Top Layer w0.251: 8.6,43.42 8.6,57.78 7.87,58.51 7.36,58.51
  Top Layer w0.254: 59.79,42.81 58.64,42.81 58.03,43.42 58.03,54.13 58.75,54.85 59.85,54.85 ; 58.1,48.83 60.17,48.83 ; 69.41,24.96 62.18,24.96 61.39,25.74 61.39,26.54 ; 58.77,60.62 59.92,60.62
  Top Layer w0.355: 31.87,31.1 47.31,31.1
  Top Layer w0.533: 47.71,42.03 53.62,42.03 56.18,44.59 ; 39.67,44.56 37.08,41.97 31.2,41.97
  Top Layer w0.559: 84.85,58.92 66.62,58.92 63.4,62.14 60.45,62.14 59.94,61.63 59.94,60.69 ; 23.23,44.58 20.66,42.01 14.7,42.01
  Top Layer w0.584: 76.99,23.59 76.99,25.74
  Top Layer w0.94: 45.93,19.08 44.26,19.08 43.07,20.27 43.07,23.11 42,24.18 36.13,24.18 35.64,23.7 35.64,22.65 35.47,22.48 ; 33.09,22.48 32.07,23.5 31.75,23.5 31.72,23.47 31.72,22.77 29.22,20.27 21.57,20.27 21.52,20.32 21.62,20.32 ; 28.31,19.7 28.31,18.7 26.1,16.49 22.84,16.49
  Bottom Layer w0.28: 8.61,43.4 12.98,43.4 13.98,42.4 ; 58.79,60.57 59.48,59.88 59.48,55.67 58.68,54.88 58.68,54.85 ; 69.59,24.93 76.02,24.93 76.82,25.74
  Bottom Layer w0.381: 31.77,31.1 31.77,22.7 31.4,22.33 ; 23.35,44.94 23.56,44.94 24.61,45.99 28.55,45.99 30.86,43.68 30.86,42.02 ; 39.77,44.62 41.15,46.01 44.96,46.01 47.36,43.62 47.36,31.07
  Bottom Layer w0.559: 45.99,19.07 46.03,19.07 48.43,16.66 70.11,16.66 76.95,23.5
  Bottom Layer w0.584: 56.18,44.58 56.87,44.58 58.61,42.85
  vias: v1(8.57,43.39) v1(31.37,22.33) v1(31.81,31.08) v1(45.96,19.16) v1(47.34,31.14) v1(58.6,42.85) v1(58.73,60.61) v1(58.7,54.84) v1(69.52,24.97)
UNNAMEDNET18: length 22.4
  Top Layer w0.254: 61.53,45.02 61.53,48.9 ; 78.38,53.48 77.52,52.62 67.44,52.62 63.6,48.78 61.76,48.78
UNNAMEDNET19: length 15.2
  Top Layer w0.254: 61.53,54.52 61.53,52.68 61.52,52.67 61.52,50.99 ; 72.45,54.13 72.33,54.13 71.34,55.11 65.21,55.11
  Bottom Layer w0.28: 61.59,53.87 63.78,53.87 65.04,55.14
  vias: v1(61.55,53.87) v1(65.1,55.17)
UNNAMEDNET20: length 9.2
  Top Layer w0.254: 61.52,60.4 61.52,56.91 61.64,56.79 62.27,56.79 65.28,53.77 65.95,53.77
UNNAMEDNET21: length 166.3
  Top Layer w0.254: 25.39,34.03 22.35,34.03 21.53,34.85 21.53,36.03 20.65,36.9 12.37,36.9 7.81,41.47 7.81,56.07 7.37,56.5 7.25,56.5 ; 56.26,23.75 56.26,20.63 61.08,15.81 61.08,13.16 ; 27.02,29.25 28.27,29.25
  Top Layer w0.533: 88.45,52.02 87.35,50.93 87.35,43.2 88.32,42.24 88.32,37.7
  Top Layer w0.559: 88.45,52.02 88.47,52.02
  Top Layer w0.584: 70.77,26.87 71.24,26.87 71.92,27.56
  Top Layer w0.94: 35.15,29.27 42.8,29.27 44.49,27.58 44.49,21.18 45.19,20.48 47.12,20.48 48.95,18.65 48.95,14.01 47.31,12.37 45.38,12.37 ; 70.58,26.6 70.58,23.9 70.47,23.79 51.05,23.79 51,23.84 51,26.63 ; 29.45,23.78 29.45,26.43 ; 57.38,24.07 57.38,26.58 ; 49.13,16.17 51.07,16.17
  Bottom Layer w0.28: 26.93,29.31 25.42,30.82 25.42,34.03
  Bottom Layer w0.584: 72,27.6 72.06,27.6 73.37,28.91 83.69,28.91 84.97,30.19 84.97,36.77 85.87,37.67 88.24,37.67
  Bottom Layer w0.914: 44.5,25.28 50.95,25.28
  vias: v1(25.42,34.07) v1(27.04,29.27) v1(71.95,27.56) v1(88.3,37.74)
UNNAMEDNET22: length 92.7
  Top Layer w0.254: 55.3,27.81 55.57,27.81 56.21,28.45 57.45,28.45 59.45,30.44 62.4,30.44 ; 86.11,48.48 86.11,43.01 87.5,41.61 87.5,36.92
  Bottom Layer w0.28: 87.4,36.91 86.39,36.91 86.01,36.53 86.01,22.33 85.62,21.95 83.63,21.95 82.48,23.1 82.16,23.1 80.27,21.2 78.87,21.2 73.64,15.98 73.64,9.01 79.09,3.55 79.09,3.22 ; 62.42,30.45 65.89,30.45 69.7,26.64 73.82,26.64 75.28,28.11 85.93,28.11
  vias: v1(62.44,30.47) v1(87.48,36.93)
UNNAMEDNET23: length 29.7
  Top Layer w0.254: 58.8,50.82 59.93,50.82 ; 67.27,50.26 67.38,50.26 68.72,51.6 83.9,51.6 84.81,50.69 84.81,49.51
  Bottom Layer w0.28: 58.67,50.86 58.67,50.85 59.29,50.23 67.33,50.23
  vias: v1(58.73,50.82) v1(67.29,50.26)
UNNAMEDNET24: length 30.5
  Top Layer w0.254: 63.82,44.95 63.82,46.8 65.84,48.82 68.36,48.82 70.64,51.1 83.02,51.1 83.59,50.54 83.59,49.74 ; 58.67,44.83 59.73,44.83
  Bottom Layer w0.28: 58.7,44.79 63.74,44.79
  vias: v1(58.67,44.81) v1(63.83,44.86)
UNNAMEDNET25: length 33.6
  Top Layer w0.254: 82.24,49.55 82.24,50.34 81.98,50.6 70.93,50.6 68.65,48.32 66.13,48.32 64.51,46.7 64.51,39.62 62.49,37.6 60.42,37.6 59.97,38.05 59.97,38.7
UNNAMEDNET26: length 52.9
  Top Layer w0.254: 78.8,16.17 77.54,14.91 72.68,14.91 70.59,17 70.59,21.97 ; 86.7,36.27 86.7,41.4 81.03,47.07 81.03,48.36
  Bottom Layer w0.28: 86.69,36.15 86.69,21.64 81.52,16.47 79.42,16.47
  vias: v1(86.7,36.23)
UNNAMEDNET27: length 49
  Top Layer w0.254: 79.74,47.59 79.74,48.25 ; 67.29,47.47 65.52,45.7 65.52,38.83 63.03,36.34 53.36,36.34 51.02,38.68 50.77,38.68 49.9,37.8 48.11,37.8 47.45,38.47 47.45,39.92 47.06,40.31 45.26,40.31 43.8,41.76 43.8,41.76
  Bottom Layer w0.28: 67.37,47.54 79.73,47.54
  vias: v1(67.35,47.53) v1(79.76,47.56)
UNNAMEDNET28: length 51.6
  Top Layer w0.254: 43.57,44.65 45.62,42.59 45.62,41.41 46.21,40.83 51.57,40.83 52.54,39.86 52.54,38.06 53.69,36.92 62.71,36.92 65.04,39.25 65.04,46.23 65.63,46.82 65.63,46.85 ; 78.46,46.86 78.46,48.47 ; 48.62,39.11 48.62,40.18 47.98,40.82
  Bottom Layer w0.28: 65.68,46.89 78.48,46.89
  vias: v1(65.67,46.9) v1(78.48,46.83)
UNNAMEDNET29: length 66.5
  Top Layer w0.254: 27.33,41.63 27.44,41.63 28.8,40.28 30.52,40.28 30.95,39.85 30.95,38.48 31.62,37.8 33.46,37.8 34.49,38.84 34.61,38.84 34.68,38.77 34.68,37.56 37.09,35.14 63.62,35.14 66.9,38.42 66.9,46.12 ; 77.22,46.06 77.22,48.62
  Bottom Layer w0.28: 66.95,46.13 77.23,46.13
  vias: v1(66.96,46.16) v1(77.23,46.08)
UNNAMEDNET30: length 67.4
  Top Layer w0.254: 32.12,39.22 32.12,40.21 31.57,40.75 ; 66.26,45.32 66.26,38.62 63.35,35.71 37.47,35.71 36.04,37.13 36.04,40 35.24,40.8 29.74,40.8 29.16,41.39 29.16,42.58 27.21,44.53 ; 75.93,45.41 75.93,48.49
  Bottom Layer w0.28: 66.32,45.33 75.85,45.33
  vias: v1(66.24,45.33) v1(75.92,45.37)
UNNAMEDNET31: length 81.2
  Top Layer w0.254: 18.19,37.97 18.19,38.82 ; 68.34,44.59 68.34,37.95 64.32,33.93 36.5,33.93 33.73,36.7 30.98,36.7 30.28,37.4 21.97,37.4 21.44,37.93 15.09,37.93 14.48,38.54 14.48,39.96 14.13,40.31 12.3,40.31 10.7,41.91 10.69,41.91 ; 74.67,44.57 74.67,48.58
  Bottom Layer w0.28: 68.35,44.59 74.63,44.59
  vias: v1(68.32,44.6) v1(74.68,44.55)
UNNAMEDNET32: length 81.2
  Top Layer w0.254: 67.61,43.83 67.61,38.18 63.97,34.54 36.76,34.54 34.09,37.21 31.33,37.21 30.61,37.93 27.83,37.93 24.96,40.8 13.3,40.8 12.67,41.43 12.67,42.6 10.58,44.69 ; 15.09,40.76 15.71,40.14 15.71,39.35 ; 73.37,43.85 73.37,48.55
  Bottom Layer w0.28: 67.56,43.83 73.28,43.83
  vias: v1(67.61,43.83) v1(73.33,43.84)
UNNAMEDNET34: length 20
  Top Layer w0.254: 64.22,27.68 65,27.68 66.19,28.87 66.19,34.98 68.92,37.71 68.92,44.09 69.45,44.62 69.87,44.62
UNNAMEDNET41: length 33.5
  Top Layer w0.254: 68.01,35.65 70.07,35.65 ; 59.85,56.84 58.55,56.84 57.53,55.82 57.53,38.97 58.95,37.56
  Bottom Layer w0.28: 59.02,37.65 59.02,37.52 60.93,35.61 67.95,35.61
  vias: v1(58.93,37.6) v1(68.01,35.61)
UNNAMEDNET42: length 44
  Top Layer w0.254: 87.22,10.96 87.22,12.52 86.11,13.63 71.45,13.63 66.19,18.89 66.19,21.97 ; 67.3,25.71 67.3,33.22 68.46,34.39 69.83,34.39
  Bottom Layer w0.28: 66.25,21 66.38,21 67.3,21.92 67.3,25.64
  vias: v1(66.19,20.98) v1(67.32,25.69)
UNNAMEDNET43: length 25.1
  Top Layer w0.254: 48.91,27.72 49.64,28.45 51.27,28.45 52.05,27.67 53.7,27.67 57.17,31.14 63.17,31.14 ; 67.97,31.14 71.91,31.14
  Bottom Layer w0.28: 63.16,31.13 67.97,31.13
  vias: v1(63.19,31.17) v1(67.98,31.13)
UNNAMEDNET44: length 5.7
  Top Layer w0.254: 68.61,28.63 68.62,28.63 69.53,29.54 73,29.54 73.31,29.86 73.31,30.31
UNNAMEDNET45: length 146.5
  Top Layer w0.254: 46.03,31.94 63.73,31.94 ; 74.4,30 74.4,30.36 ; 43.37,59.83 42.22,58.69 42.22,40.93 44.05,39.09 45.86,39.09 ; 74.74,30.25 73.22,28.72 70.86,28.72 70.65,28.52 70.65,28.5 ; 29.42,36.74 21.72,36.74 21.05,37.42 14.73,37.42 13.03,39.12 11.07,39.12 9.28,40.91 9.28,58.76 10.4,59.89 ; 29.03,39.11 27.56,39.11 25.78,40.89 25.78,58.75 26.94,59.91 26.94,59.97
  Bottom Layer w0.28: 29.46,37.5 45.95,37.5 ; 71.72,28.79 68.6,31.91 63.74,31.91 ; 29.41,36.78 29.41,39.05 ; 46,32.03 46,38.96
  vias: v1(29.4,36.72) v1(46.01,31.98) v1(63.73,31.95) v1(71.75,28.81)
UNNAMEDNET46: length 39.4
  Top Layer w0.254: 75.92,30.66 75.92,30.31 71.97,26.36 71.97,21.3 71.48,20.81 ; 86.83,16.07 85.08,14.32 72.07,14.32 68.38,18.01 68.38,21.95
  Bottom Layer w0.28: 68.42,20.78 71.47,20.78
  vias: v1(68.39,20.83) v1(71.47,20.78)
UNNAMEDNET47: length 38.5
  Top Layer w0.254: 59.57,21.71 59.57,19.11 63.28,15.4 63.28,13.14 ; 77.16,31.6 77.16,32.67
  Bottom Layer w0.28: 77.15,32.61 62.8,32.61 59.62,29.43 59.62,20.95
  vias: v1(59.56,20.97) v1(77.15,32.65)
UNNAMEDNET48: length 43.4
  Top Layer w0.254: 59.99,12.99 59.99,15.86 56.29,19.56 56.29,19.63 ; 78.43,31.53 78.43,32.69
  Bottom Layer w0.28: 56.33,19.58 56.33,27.97 62.26,33.9 78.1,33.9 78.49,33.52 78.49,32.65
  vias: v1(56.27,19.65) v1(78.43,32.7)
UNNAMEDNET49: length 49.5
  Top Layer w0.254: 79.72,31.27 79.72,32.75 ; 53.19,22.08 53.19,20.28 57.77,15.7 57.77,13.16
  Bottom Layer w0.28: 54.12,19.42 54.12,26.63 61.88,34.39 78.97,34.39 79.74,33.62 79.74,32.75
  vias: v1(54.06,19.42) v1(79.69,32.71)
UNNAMEDNET51: length 52.5
  Top Layer w0.254: 82.26,31.7 82.26,32.67 ; 55.58,12.92 55.58,16.84 51.03,21.39 51.03,22.09
  Bottom Layer w0.28: 52.31,20.24 52.31,25.73 61.49,34.92 80.56,34.92 82.3,33.18 82.3,32.73
  vias: v1(52.28,20.15) v1(82.26,32.68)
UNNAMEDNET52: length 49
  Top Layer w0.254: 83.51,30.4 83.51,27.19 84.65,26.06 84.71,26.06 ; 45.9,14.94 46.98,14.94
  Bottom Layer w0.28: 84.64,25.97 84.64,25.86 83.51,24.73 81.5,24.73 80.8,24.03 80.8,22.73 80.03,21.95 78.62,21.95 71.56,14.89 47.03,14.89
  vias: v1(47.01,14.95)
UNNAMEDNET53: length 57.5
  Top Layer w0.254: 84.79,30.49 84.79,28.1 85.96,26.94 85.96,25.43 85.28,24.75 83.36,24.75 82.19,25.92 ; 45.58,13.66 46.89,13.66
  Bottom Layer w0.28: 46.96,13.66 46.55,13.66 46.13,14.07 46.13,15.42 46.4,15.68 71.33,15.68 78.32,22.67 78.32,26.82 78.81,27.32 81.22,27.32 82.18,26.36
  vias: v1(46.93,13.7)
UNNAMEDNET54: length 54.7
  Top Layer w0.254: 86.08,30.39 86.08,27.83 88.77,25.15 88.77,9.4 88.21,8.84 80.78,8.84 79.28,10.34 79.12,10.34 ; 63.98,21.92 63.98,19.89 70.74,13.13 78.31,13.13 79.22,12.22 79.22,10.56
UNNAMEDNET55: length 52.2
  Top Layer w0.254: 62.19,13.06 62.19,15.67 57.38,20.48 57.38,21.95 ; 87.16,31.84 87.16,32.22 ; 87.28,31.76 87.28,32.18 86.12,33.34 77.85,33.34
  Bottom Layer w0.28: 58.21,19.79 58.21,28.94 62.57,33.31 77.81,33.31
  vias: v1(58.16,19.73) v1(77.81,33.33)
UNNAMEDNET59: length 98.9
  Top Layer w0.559: 52.55,0.96 52.81,0.96 55.28,3.43 68.93,3.43 69.97,2.39 70.11,2.39 ; 28.74,2.9 28.74,7.15 ; 67.75,3.5 67.75,10.41 69.06,11.72 ; 56.13,3.6 56.13,9.65 54.19,11.6
  Top Layer w0.584: 69.06,11.72 69.09,11.72
  Bottom Layer w0.533: 6.45,3.29 12.88,3.29 14.98,1.19 17.42,1.19 18.8,2.58 21.71,2.58 23.3,0.99 29.08,0.99 29.83,1.74 29.83,6.72 30.52,7.4 40.95,7.4 41.85,6.5 41.85,3.92 44.89,0.88 52.64,0.88
  vias: v1(52.57,0.95)
UNNAMEDNET60: length 12.5
  Top Layer w0.254: 43.63,52.25 43.65,52.25 45.18,50.73 45.18,48.91 46.54,47.55 50.46,47.55 52.31,49.4
UNNAMEDNET61: length 11.3
  Top Layer w0.254: 43.78,54.52 43.89,54.52 45.77,52.64 45.77,49.11 46.73,48.14 48.5,48.14 49.86,49.5
UNNAMEDNET62: length 9.1
  Top Layer w0.254: 47.14,49.82 46.36,50.6 46.36,54.63 43.56,57.43 43.55,57.43
UNNAMEDNET63: length 12.8
  Top Layer w0.254: 27.03,52.16 27.24,52.16 28.65,50.75 28.65,48.95 30.08,47.52 33.86,47.52 35.96,49.63
UNNAMEDNET64: length 11.8
  Top Layer w0.254: 33.42,49.47 33.27,49.47 31.93,48.12 30.27,48.12 29.26,49.13 29.26,52.68 27.06,54.89
UNNAMEDNET65: length 9.5
  Top Layer w0.254: 27.06,57.45 29.86,54.64 29.86,50.58 30.73,49.71 30.73,49.43
UNNAMEDNET66: length 2.2
  Top Layer w0.533: 43.55,47.34 43.55,49.55
UNNAMEDNET67: length 2.1
  Top Layer w0.559: 27.04,47.38 27.04,49.53
UNNAMEDNET68: length 2.3
  Top Layer w0.559: 10.59,47.29 10.59,49.59
UNNAMEDNET69: length 12.5
  Top Layer w0.254: 19.38,49.52 17.41,47.55 13.61,47.55 12.2,48.95 12.2,50.72 10.79,52.13 10.68,52.13
UNNAMEDNET70: length 11.2
  Top Layer w0.254: 10.78,54.7 10.8,54.7 12.81,52.68 12.81,49.14 13.8,48.15 15.48,48.15 16.67,49.34
UNNAMEDNET71: length 8.8
  Top Layer w0.254: 14.13,49.91 13.42,50.62 13.42,54.63 10.82,57.22 10.7,57.22
UNNAMEDNET72: length 14.4
  Top Layer w1.931: 4.35,42 5.11,42 14.73,32.37
UNNAMEDNET73: length 1.2
  Top Layer w0.251: 4.46,60.58 5.63,60.58
UNNAMEDNET74: length 1.4
  Top Layer w0.251: 4.28,58.58 5.71,58.58
UNNAMEDNET75: length 1.5
  Top Layer w0.251: 4.26,56.62 5.75,56.62
UNNAMEDNET76: length 61.8
  Top Layer w0.508: 14.21,26.66 7.94,26.66 7.67,26.4 7.67,24.97 8.91,23.73 19.17,23.73
  Bottom Layer w0.28: 3.67,37.95 3.67,35.26 7.4,31.52 7.4,24.72 8.47,23.65 12.91,23.65 13.68,24.43 13.68,31.12 6.33,38.47 4.17,38.47 3.68,37.97
UNNAMEDNET77: length 8
  Top Layer w0.254: 31.5,32.71 28.59,32.71 26.95,31.07 24.15,31.07
UNNAMEDNET78: length 48
  Top Layer w0.254: 65.51,29.84 65.51,32.24 64.43,33.31 36.16,33.31 34.37,35.1 32.52,35.1 32.4,34.97 32.4,34.5 31.79,33.89 29.6,33.89 28.54,34.96 ; 68.41,25.68 68.41,26.63
  Bottom Layer w0.28: 65.5,29.75 68.42,26.83 68.42,25.66
  vias: v1(65.49,29.77) v1(68.43,25.67)
UNNAMEDNET79: length 1.9
  Top Layer w0.533: 14.54,19.81 14.54,18.71 14,18.18 14,18.16
UNNAMEDNET80: length 6.3
  Top Layer w0.533: 14.65,21.81 17.56,21.81 17.98,21.39 17.98,20.33 18.04,20.27 19.71,20.27
UNNAMEDNET81: length 6.1
  Top Layer w0.94: 15.38,16.53 12.9,16.53 12.34,17.1 12.34,18.09 11.76,18.66 11.76,19.66
UNNAMEDNET82: length 18.4
  Top Layer w1.931: 5.5,14.46 10.5,14.46 11.6,13.36 11.6,9.69 ; 19.96,10.56 18.69,11.83 12.3,11.83
UNNAMEDNET83: length 5
  Top Layer w0.254: 34.77,12.03 35.03,12.03 36.83,13.84 36.83,14.31 37.22,14.7 38.39,14.7
UNNAMEDNET84: length 14.4
  Top Layer w0.254: 37.41,11.71 38.5,10.62 38.5,9.43 37.62,8.55 33.76,8.55 32.5,9.81 32.5,14.56
UNNAMEDNET85: length 10.9
  Top Layer w0.254: 34.5,10.28 34.38,10.28 33.21,11.46 33.21,12.8 33.81,13.4 35.68,13.4 36.08,13.81 36.08,15.85 36.82,16.59 38.23,16.59
UNNAMEDNET86: length 8.9
  Top Layer w0.533: 39.18,20.28 37.49,20.28 37.35,20.42 36.62,20.42 35.46,19.26 35.46,17.13 34.91,16.58 33.16,16.58
UNNAMEDNET87: length 1.2
  Top Layer w0.254: 39.67,21.96 40.88,21.96
UNNAMEDNET88: length 6
  Top Layer w0.254: 42.15,14.47 42.15,11.73 44.02,9.86 44.63,9.86
UNNAMEDNET89: length 6.9
  Top Layer w0.254: 44.65,11.1 44.19,11.1 43.15,12.13 43.15,15.59 42.39,16.36 41.97,16.36
UNNAMEDNET90: length 5.8
  Top Layer w0.254: 46.34,28.59 46.34,28.52 45.39,27.56 45.39,25.87 46.6,24.65 46.6,23.73
UNNAMEDNET91: length 18.7
  Top Layer w0.254: 46.52,26.58 46.52,25.77 47.7,24.59 47.7,22.98 48.82,21.87 48.82,21.46 49.4,20.88 50.55,20.88 53.38,18.05 53.38,13.75 52.04,12.41 51.58,12.41
UNNAMEDNET92: length 11.1
  Top Layer w0.254: 48.72,23.9 48.72,24.48 47.73,25.47 47.73,28.55 48.92,29.75 51.99,29.75 52.63,29.12 52.63,28.78
UNNAMEDNET93: length 21.5
  Top Layer w0.254: 53.18,25.71 53.18,26.57 ; 46.77,22.06 48.41,20.41 49.88,20.41 52.68,17.62 52.68,14 52.32,13.64 51.84,13.64
  Bottom Layer w0.28: 52.44,17.84 52.61,17.84 53.22,18.45 53.22,25.67
  vias: v1(52.49,17.79) v1(53.15,25.7)
UNNAMEDNET95: length 2.4
  Top Layer w0.254: 61.22,28.5 59.62,26.9 59.47,26.9
UNNAMEDNET96: length 11.4
  Top Layer w0.254: 45.75,8.57 47.31,8.57 48.58,7.31 48.58,4.78 49.1,4.26 50.49,4.26 50.82,3.93 50.82,1.03
UNNAMEDNET97: length 10
  Top Layer w0.254: 45.64,7.3 47.14,7.3 47.77,6.66 47.77,5.05 46.95,4.22 45.43,4.22 45.24,4.04 45.24,0.96

## Copper pours and planes (outline as drawn; the poured copper is in the pictures)
UNNAMEDNET13 on Top Layer: 33.86,15.73 35.44,15.73 35.44,14.11 33.86,14.11
UNNAMEDNET13 on Top Layer: 12.66,0.17 83.27,0.17 82.02,1.55 81.4,3.31 81.49,5.17 82.3,6.86 82.98,7.6 83.8,8.18 86.34,8.17 88.22,10.05 88.22,23.98 89.89,25.65 89.89,63.08 88.56,61.82 86.84,61.17 85.01,61.22 83.33,61.98 82.07,63.31 81.42,65.03 81.48,66.86 82.23,68.54 82.71,69.1 83.26,69.59 7.03,69.6 7.04,69.59 8.25,68.21 8.85,66.48 8.73,64.65 7.93,63 6.55,61.79 4.82,61.2 2.99,61.31 1.35,62.11 0.88,62.52 0.47,62.99 0.47,15.05 1.31,14.2 10.88,14.2 11.77,13.31 11.77,10.12 10.92,9.27 10.92,3.43 12.19,2.16 12.19,0.87
UNNAMEDNET13 on Bottom Layer: 8.79,4.12 12.64,4.11 14.89,1.87 44.35,1.87 45.85,0.37 82.85,0.37 81.74,1.84 81.27,3.62 81.52,5.45 82.45,7.04 83.92,8.16 85.71,8.63 87.53,8.38 89.13,7.45 89.32,7.27 89.5,7.08 89.5,62.69 87.97,61.6 86.14,61.18 84.28,61.49 82.69,62.49 81.6,64.02 81.18,65.85 81.49,67.7 82.49,69.3 82.51,69.32 7.14,69.32 8.26,67.54 8.73,65.49 8.73,61.11 0.68,53.07 0.68,7.19 2.17,8.24 3.95,8.63 5.75,8.32 7.29,7.34 8.3,5.91 8.72,4.22
UNNAMEDNET14 on Bottom Layer: 4.54,49.07 2.29,49.07 0.97,50.39 0.97,56.46 9.41,64.9 11.63,64.9 11.98,64.55 11.98,63.7 11.71,63.43 10.09,63.43 2.39,55.72 2.39,51.05 2.76,50.68 4.59,50.68 5.06,50.21 5.06,49.55 4.62,49.11
UNNAMEDNET17 on Top Layer: 33.13,22.97 35.54,22.97 35.54,21.99 33.13,21.99
UNNAMEDNET21 on Top Layer: 27.71,30.21 37.05,30.21 37.05,25.52 27.71,25.52
UNNAMEDNET76 on Top Layer: 8.85,23.91 14.44,23.91 15.13,24.61 15.13,25.54 14,26.67 8.2,26.67 7.78,26.25 7.78,25
UNNAMEDNET76 on Bottom Layer: 8.49,23.79 12.82,23.79 13.52,24.49 13.52,31.06 6.22,38.36 4.22,38.36 3.75,37.89 3.75,35.39 7.48,31.66 7.48,24.77 8.3,23.95

Small or netless copper shapes (teardrops, artwork), in the pictures only: 3 on Bottom Layer

## Text on the board
Bottom Silkscreen Layer: Stret | 2A | 2B | 5V | Reset | Y2-Motor | VIN | Z-Motor | Pre | EN | RST | DIR | SLP | STP | 1A | X-Motor | 1B | Y1-Motor | VCC | Probe | PUMP- | SPINDLE- | GND | M2 | Z-Limt | Hold | Y-Limt | X-Limt | M1 | MO | M0 | PWM | Run | ESP32-Axis3-6.0 | V1.0
Mechanical Layer: T=1.6MM
Top Silkscreen Layer: Start | 5V | 3V3 | VIN | Pre | S | Reset | Earth | ON | -VIN+ | Switch | EN | MO | STP | DIR | -SPINDLE+ | +PUINP- | GND | Run | Probe | Z-Limt | Y-Limt | X-Limt | Hold | X-MOTOR | M2 | +VIN- | Y1-MOTOR | Y2-MOTOR | Z-MOTOR | PWM | TX | RX | X | Z | Y
